# EAGLE board AnalogConversion_v3 (EAGLE 9.6.2)
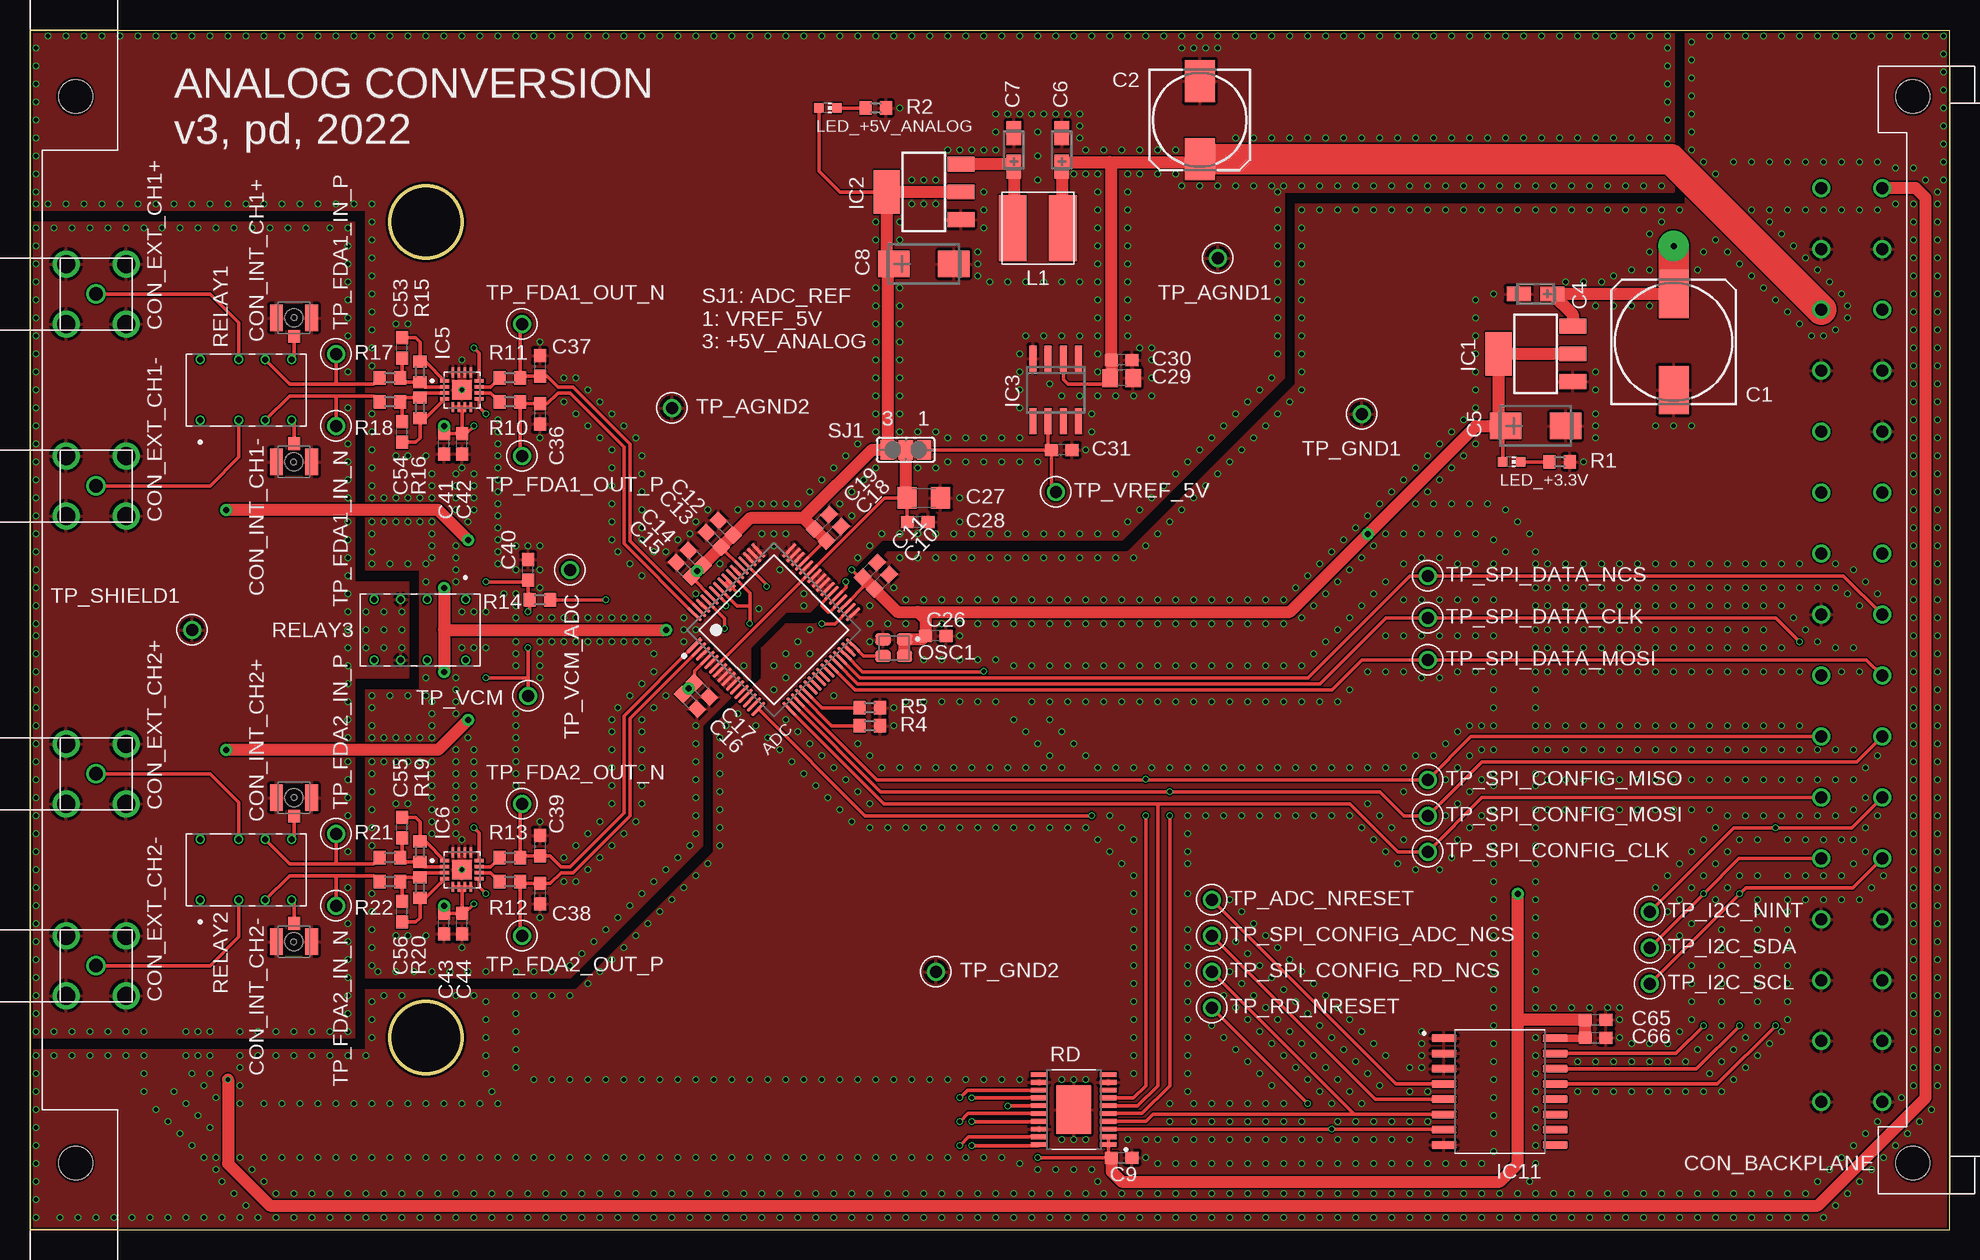
[diagram p6: board, top side]
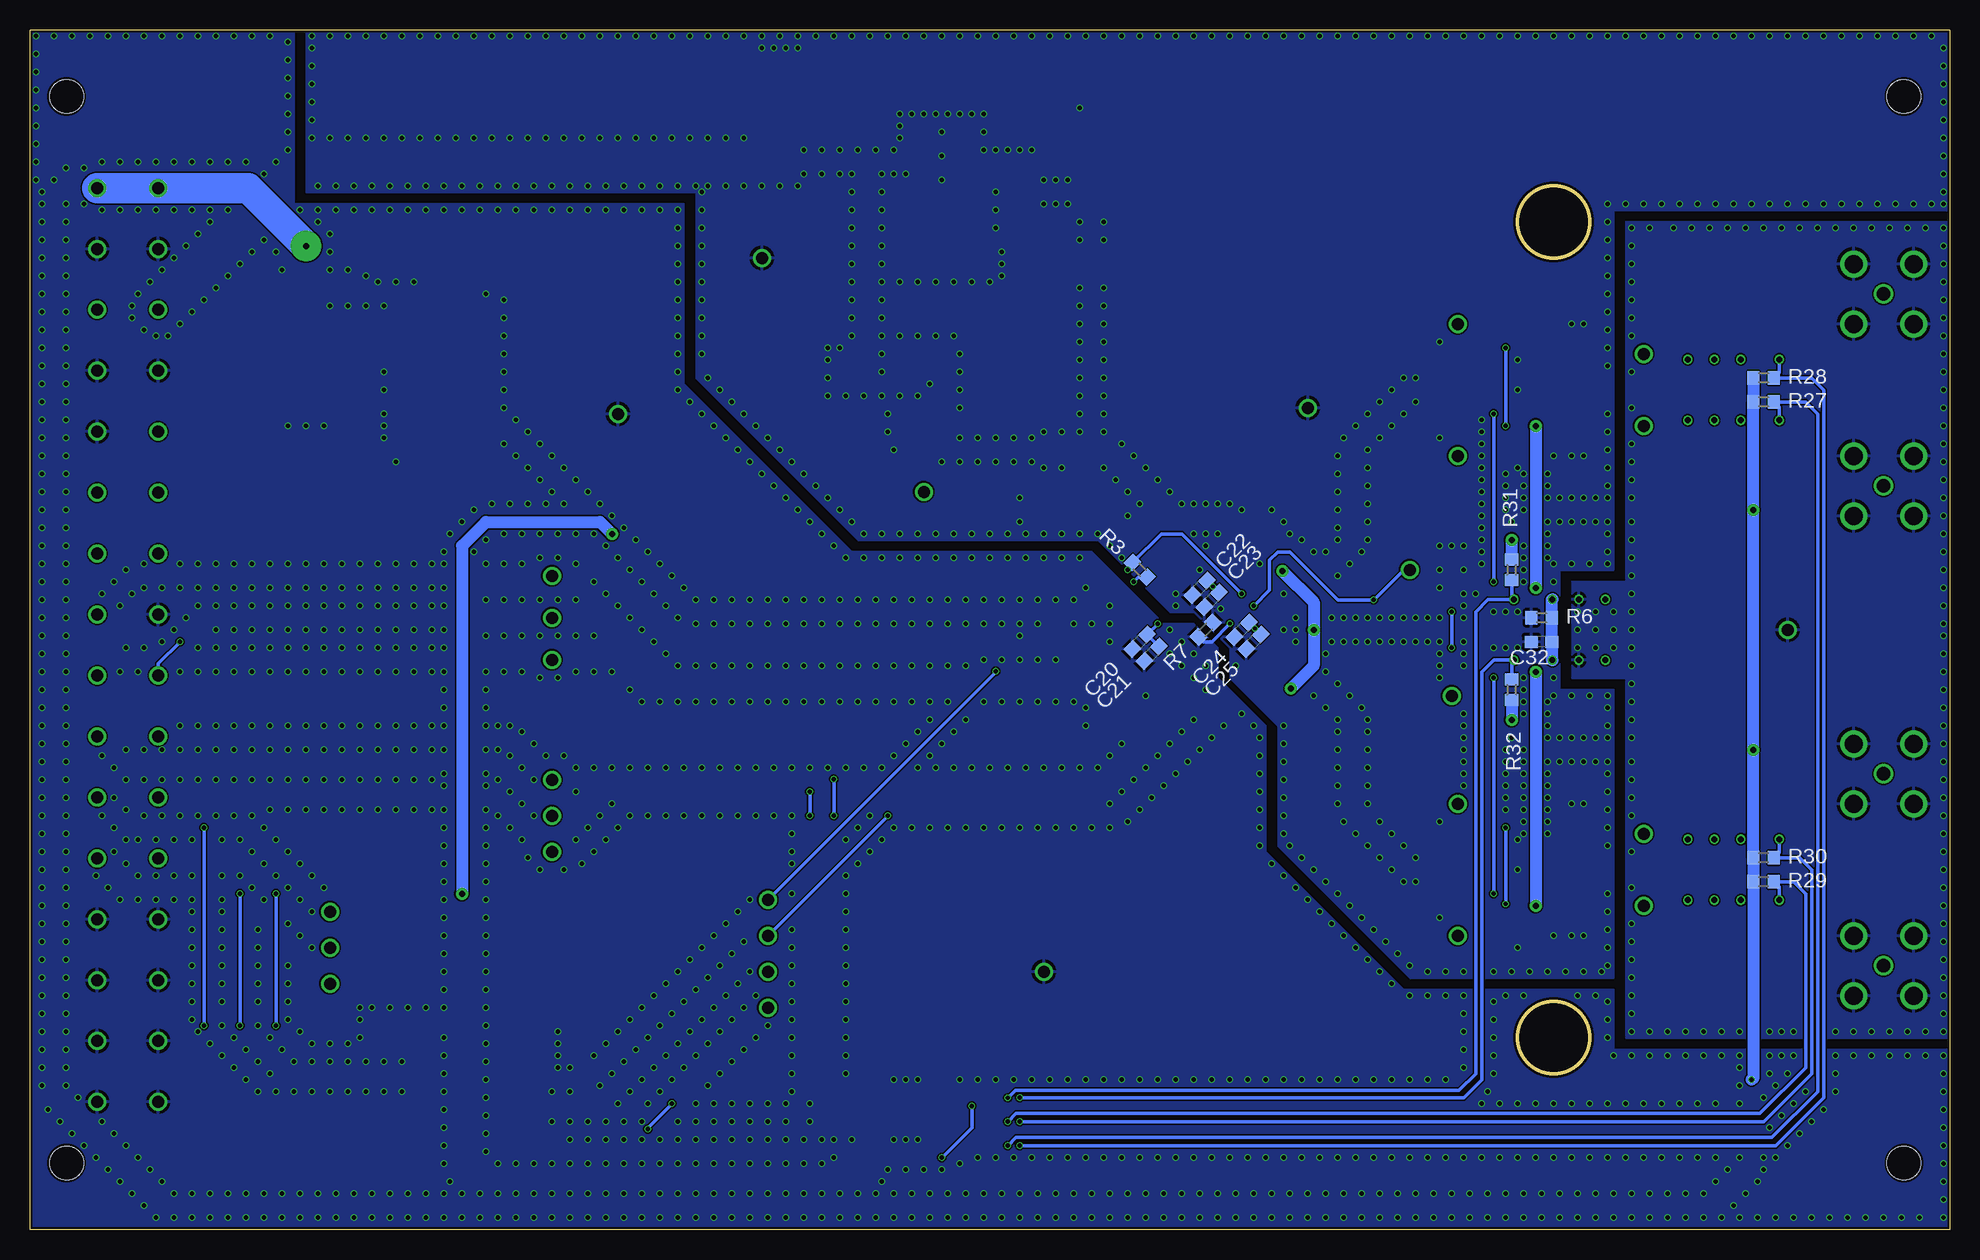
[diagram p7: board, bottom side, seen from below]

Size 160 x 100 mm. Coordinates in mm from the lower left corner, seen from the top.
Outline: 0,0 160,0 160,100 0,100 0,0
Outline: circle at 33,84 radius 3
Outline: circle at 33,16 radius 3
Copper layers (1*16): Top 0.035559375mm / dielectric 1.6mm / Bottom 0.035559375mm
Design rules "jlcpcb2layer": minimum track width 5mil, minimum drill 12mil, track to track 5mil, track to pad 5mil, pad to pad 5mil, via to via 5mil, smd to smd 5mil, copper to edge 8mil, drill to drill 6mil, minimum pad ring 5mil, minimum via ring 3mil, stop-mask expansion 2.5mil, vias tented up to drill 0mil, thermal gap 10mil

## Footprints (pad centres in the part's own frame; a part is rotated, then mirrored left to right if it is on the bottom)
AD7768-4BSTZ = smd 1.6 x 0.312: 1 -5.575,3.75; 2 -5.575,3.25; 3 -5.575,2.75; 4 -5.575,2.25; 5 -5.575,1.75; 6 -5.575,1.25; 7 -5.575,0.75; 8 -5.575,0.25; 9 -5.575,-0.25; 10 -5.575,-0.75; 11 -5.575,-1.25; 12 -5.575,-1.75; 13 -5.575,-2.25; 14 -5.575,-2.75; 15 -5.575,-3.25; 16 -5.575,-3.75; 33 5.575,-3.75; 34 5.575,-3.25; 35 5.575,-2.75; 36 5.575,-2.25; 37 5.575,-1.75; 38 5.575,-1.25; 39 5.575,-0.75; 40 5.575,-0.25; 41 5.575,0.25; 42 5.575,0.75; 43 5.575,1.25; 44 5.575,1.75; 45 5.575,2.25; 46 5.575,2.75; 47 5.575,3.25; 48 5.575,3.75 | smd 0.312 x 1.6: 17 -3.75,-5.575; 18 -3.25,-5.575; 19 -2.75,-5.575; 20 -2.25,-5.575; 21 -1.75,-5.575; 22 -1.25,-5.575; 23 -0.75,-5.575; 24 -0.25,-5.575; 25 0.25,-5.575; 26 0.75,-5.575; 27 1.25,-5.575; 28 1.75,-5.575; 29 2.25,-5.575; 30 2.75,-5.575; 31 3.25,-5.575; 32 3.75,-5.575; 49 3.75,5.575; 50 3.25,5.575; 51 2.75,5.575; 52 2.25,5.575; 53 1.75,5.575; 54 1.25,5.575; 55 0.75,5.575; 56 0.25,5.575; 57 -0.25,5.575; 58 -0.75,5.575; 59 -1.25,5.575; 60 -1.75,5.575; 61 -2.25,5.575; 62 -2.75,5.575; 63 -3.25,5.575; 64 -3.75,5.575
153CLV-1010 = smd 4 x 2.5: + 4,0; - -4,0
153CLV-0810 = smd 3.5 x 2.5: + 3.25,0; - -3.25,0
CT3216 = smd 2 x 1.2: + -1.4,0; - 1.4,0
CT6032 = smd 2.6 x 2.2: + -2.5,0; - 2.5,0
C0603 = smd 1.1 x 1: 1 -0.85,0; 2 0.85,0
C1206 = smd 1.6 x 1.8: 1 -1.4,0; 2 1.4,0
C0805 = smd 1.3 x 1.5: 1 -0.95,0; 2 0.95,0
09031326921 = drill 1: 1 36.83,10.7; 2 36.83,5.62; 3 31.75,10.7; 4 31.75,5.62; 5 26.67,10.7; 6 26.67,5.62; 7 21.59,10.7; 8 21.59,5.62; 9 16.51,10.7; 10 16.51,5.62; 11 11.43,10.7; 12 11.43,5.62; 13 6.35,10.7; 14 6.35,5.62; 15 1.27,10.7; 16 1.27,5.62; 17 -3.81,10.7; 18 -3.81,5.62; 19 -8.89,10.7; 20 -8.89,5.62; 21 -13.97,10.7; 22 -13.97,5.62; 23 -19.05,10.7; 24 -19.05,5.62; 25 -24.13,10.7; 26 -24.13,5.62; 27 -29.21,10.7; 28 -29.21,5.62; 29 -34.29,10.7; 30 -34.29,5.62; 31 -39.37,10.7; 32 -39.37,5.62 | hole 2.8: -44.45,3.05; 44.45,3.05
DELOCK_65848 = drill 1.5: G1 -2.5,2.5; G2 2.5,2.5; G3 -2.5,-2.5; G4 2.5,-2.5 | drill 1.1: S 0,0
2337019-1 = smd 1.05 x 2.2: G1 1.475,0; G2 -1.475,0 | smd 1 x 1.05: S 0,-1.525
SOT223 = smd 2.235 x 1.219: 1 -3.099,2.311; 2 -3.099,0; 3 -3.099,-2.311 | smd 2.2 x 3.6: TAB 3.099,0
ADR445ARZ = smd 0.6 x 2.2: 1 -1.905,-2.6; 2 -0.635,-2.6; 3 0.635,-2.6; 4 1.905,-2.6; 5 1.905,2.6; 6 0.635,2.6; 7 -0.635,2.6; 8 -1.905,2.6
ADA4945-1ACPZ-R7 = smd 0.84 x 0.26: 1 -1.435,0.75; 2 -1.435,0.25; 3 -1.435,-0.25; 4 -1.435,-0.75; 9 1.435,-0.75; 10 1.435,-0.25; 11 1.435,0.25; 12 1.435,0.75 | smd 0.26 x 0.84: 5 -0.75,-1.435; 6 -0.25,-1.435; 7 0.25,-1.435; 8 0.75,-1.435; 13 0.75,1.435; 14 0.25,1.435; 15 -0.25,1.435; 16 -0.75,1.435 | smd 1.6 x 1.6: 17 0,0
TCA9534ADWR = smd 2.06 x 0.6: 1 -4.64,4.445; 2 -4.64,3.175; 3 -4.64,1.905; 4 -4.64,0.635; 5 -4.64,-0.635; 6 -4.64,-1.905; 7 -4.64,-3.175; 8 -4.64,-4.445; 9 4.64,-4.445; 10 4.64,-3.175; 11 4.64,-1.905; 12 4.64,-0.635; 13 4.64,0.635; 14 4.64,1.905; 15 4.64,3.175; 16 4.64,4.445
VLS6045AF-101M = smd 2.3 x 5.5: 1 -2.1,0; 2 2.1,0
CHIP-LED0603 = smd 0.8 x 0.8: A 0,-0.75; C 0,0.75
SG-210STF-32.7680ML3 = smd 1.3 x 1: 1 -0.89,-0.69; 2 0.89,-0.69; 3 0.89,0.69; 4 -0.89,0.69
60807-011 = hole 2.8: 0,44.45; 0,-44.45
R0603 = smd 1 x 1.1: 1 -0.85,0; 2 0.85,0
MAX4820EUP+ = smd 1.48 x 0.41: 1 -2.875,2.925; 2 -2.875,2.275; 3 -2.875,1.625; 4 -2.875,0.975; 5 -2.875,0.325; 6 -2.875,-0.325; 7 -2.875,-0.975; 8 -2.875,-1.625; 9 -2.875,-2.275; 10 -2.875,-2.925; 11 2.875,-2.925; 12 2.875,-2.275; 13 2.875,-1.625; 14 2.875,-0.975; 15 2.875,-0.325; 16 2.875,0.325; 17 2.875,0.975; 18 2.875,1.625; 19 2.875,2.275; 20 2.875,2.925 | smd 2.84 x 4.04: 21 0,0
5-1462037-8 = drill 0.5: 1 -2.54,3.8; 2 -2.54,0.6; 3 -2.54,-1.6; 4 -2.54,-3.8; 5 2.54,-3.8; 6 2.54,-1.6; 7 2.54,0.6; 8 2.54,3.8
SJ_2 = smd 1.168 x 1.6: 1 -1.524,0; 2 0,0; 3 1.524,0
RSPRO-1MM-TERMINAL-POST-2622034 = drill 1: P$1 0,0

## Placement (x,y rotation side)
ADC  AD7768-4BSTZ  [AD7768-4BSTZ]  62,50 45 top
C1  1000u/16V  [153CLV-1010]  137,74 90 top
C2  100u/25V  [153CLV-0810]  97.5,92.5 270 top
C4  10u  [CT3216]  125.5,78 180 top
C5  22u  [CT6032]  125.5,67 0 top
C6  10u  [CT3216]  86,90 90 top
C7  10u  [CT3216]  82,90 90 top
C8  22u  [CT6032]  74.5,80.5 0 top
C9  100n  [C0603]  91,6 0 top
C10  100n  [C0603]  71,54 45 top
C11  1u  [C0603]  70,55 45 top
C12  100n  [C0603]  58,58.5 135 top
C13  1u  [C0603]  57,57.5 135 top
C14  100n  [C0603]  55.5,56 135 top
C15  1u  [C0603]  54.5,55 135 top
C16  100n  [C0603]  55,44 315 top
C17  1u  [C0603]  56,45 315 top
C18  100n  [C0603]  67,58 45 top
C19  1u  [C0603]  66,59 45 top
C20  100n  [C0603]  67.5,49 225 bottom
C21  10u  [C0603]  66.5,48 225 bottom
C22  100n  [C0603]  62.5,53.5 225 bottom
C23  1u  [C0603]  61.5,52.5 225 bottom
C24  100n  [C0603]  59,50 225 bottom
C25  1u  [C0603]  58,49 225 bottom
C26  100n  [C0603]  75.5,49.5 180 top
C27  22u  [C1206]  74.5,61 0 top
C28  100n  [C0603]  74,59 0 top
C29  10u/16V  [C0805]  91,71 180 top
C30  100n  [C0603]  91,72.5 180 top
C31  100n  [C0603]  86,65 180 top
C32  10n  [C0603]  34,49 180 bottom
C36  82p  [C0603]  42.5,68 270 top
C37  82p  [C0603]  42.5,72 270 top
C38  82p  [C0603]  42.5,28 270 top
C39  82p  [C0603]  42.5,32 270 top
C40  100n  [C0603]  41.5,55 90 top
C41  1u  [C0603]  34.5,65.5 90 top
C42  100n  [C0603]  36,65.5 90 top
C43  1u  [C0603]  34.5,25.5 90 top
C44  100n  [C0603]  36,25.5 90 top
C53  220p  [C0603]  31,73.5 90 top
C54  220p  [C0603]  31,66.5 90 top
C55  220p  [C0603]  31,33.5 90 top
C56  220p  [C0603]  31,26.5 90 top
C65  1u  [C0603]  130.5,17.5 0 top
C66  100n  [C0603]  130.5,16 0 top
CON_BACKPLANE  09031326921  [09031326921]  160,50 90 top
CON_EXT_CH1+  DELOCK_65848  [DELOCK_65848]  5.5,78 0 top
CON_EXT_CH1-  DELOCK_65848  [DELOCK_65848]  5.5,62 0 top
CON_EXT_CH2+  DELOCK_65848  [DELOCK_65848]  5.5,38 0 top
CON_EXT_CH2-  DELOCK_65848  [DELOCK_65848]  5.5,22 0 top
CON_INT_CH1+  2337019-1  [2337019-1]  22,76 0 top
CON_INT_CH1-  2337019-1  [2337019-1]  22,64 180 top
CON_INT_CH2+  2337019-1  [2337019-1]  22,36 0 top
CON_INT_CH2-  2337019-1  [2337019-1]  22,24 180 top
IC1  LM1117IMP-3.3  [SOT223]  125.5,73 180 top
IC2  LM1117MP-5.0  [SOT223]  74.5,86.5 180 top
IC3  ADR445ARZ  [ADR445ARZ]  85.5,70 180 top
IC5  ADA4945-1ACPZ-R7  [ADA4945-1ACPZ-R7]  36,70 0 top
IC6  ADA4945-1ACPZ-R7  [ADA4945-1ACPZ-R7]  36,30 0 top
IC11  TCA9534ADWR  [TCA9534ADWR]  122.5,11.5 0 top
L1  100u  [VLS6045AF-101M]  84,83.5 180 top
LED_+3.3V  [CHIP-LED0603]  123.5,64 270 top
LED_+5V_ANALOG  [CHIP-LED0603]  66.5,93.5 270 top
OSC1  SG-210STF 32.7680ML3  [SG-210STF-32.7680ML3]  72,48.5 180 top
PCB_BRACKET  60807-011  [60807-011]  3.8,50 0 top
R1  750  [R0603]  127.5,64 0 top
R2  1.8k  [R0603]  70.5,93.5 0 top
R3  10k  [R0603]  67.5,55 315 bottom
R4  1k  [R0603]  70,42 180 top
R5  1k  [R0603]  70,43.5 180 top
R6  1M  [R0603]  34,51 180 bottom
R7  0  [R0603]  62,50 225 bottom
R10  82  [R0603]  40,69 180 top
R11  82  [R0603]  40,71 180 top
R12  82  [R0603]  40,29 180 top
R13  82  [R0603]  40,31 180 top
R14  47  [R0603]  42.5,52.5 180 top
R15  470  [R0603]  32.5,71.5 270 top
R16  470  [R0603]  32.5,68.5 90 top
R17  470  [R0603]  30,71 180 top
R18  470  [R0603]  30,69 180 top
R19  470  [R0603]  32.5,31.5 270 top
R20  470  [R0603]  32.5,28.5 90 top
R21  470  [R0603]  30,31 180 top
R22  470  [R0603]  30,29 180 top
R27  100  [R0603]  15.5,69 180 bottom
R28  100  [R0603]  15.5,71 180 bottom
R29  100  [R0603]  15.5,29 180 bottom
R30  100  [R0603]  15.5,31 180 bottom
R31  100  [R0603]  36.5,55 90 bottom
R32  100  [R0603]  36.5,45 270 bottom
RD  MAX4820EUP+  [MAX4820EUP+]  87,10 180 top
RELAY1  5-1462037-8  [5-1462037-8]  18,70 90 top
RELAY2  5-1462037-8  [5-1462037-8]  18,30 90 top
RELAY3  5-1462037-8  [5-1462037-8]  32.5,50 270 top
SJ1  [SJ_2]  73,65 180 top
TP_ADC_NRESET  [RSPRO-1MM-TERMINAL-POST-2622034]  98.5,27.5 0 top
TP_AGND1  [RSPRO-1MM-TERMINAL-POST-2622034]  99,81 180 top
TP_AGND2  [RSPRO-1MM-TERMINAL-POST-2622034]  53.5,68.5 180 top
TP_FDA1_IN_N  [RSPRO-1MM-TERMINAL-POST-2622034]  25.5,67 0 top
TP_FDA1_IN_P  [RSPRO-1MM-TERMINAL-POST-2622034]  25.5,73 0 top
TP_FDA1_OUT_N  [RSPRO-1MM-TERMINAL-POST-2622034]  41,75.5 0 top
TP_FDA1_OUT_P  [RSPRO-1MM-TERMINAL-POST-2622034]  41,64.5 0 top
TP_FDA2_IN_N  [RSPRO-1MM-TERMINAL-POST-2622034]  25.5,27 0 top
TP_FDA2_IN_P  [RSPRO-1MM-TERMINAL-POST-2622034]  25.5,33 0 top
TP_FDA2_OUT_N  [RSPRO-1MM-TERMINAL-POST-2622034]  41,35.5 0 top
TP_FDA2_OUT_P  [RSPRO-1MM-TERMINAL-POST-2622034]  41,24.5 0 top
TP_GND1  [RSPRO-1MM-TERMINAL-POST-2622034]  111,68 0 top
TP_GND2  [RSPRO-1MM-TERMINAL-POST-2622034]  75.5,21.5 180 top
TP_I2C_NINT  [RSPRO-1MM-TERMINAL-POST-2622034]  135,26.5 0 top
TP_I2C_SCL  [RSPRO-1MM-TERMINAL-POST-2622034]  135,20.5 0 top
TP_I2C_SDA  [RSPRO-1MM-TERMINAL-POST-2622034]  135,23.5 0 top
TP_RD_NRESET  [RSPRO-1MM-TERMINAL-POST-2622034]  98.5,18.5 0 top
TP_SHIELD1  [RSPRO-1MM-TERMINAL-POST-2622034]  13.5,50 0 top
TP_SPI_CONFIG_ADC_NCS  [RSPRO-1MM-TERMINAL-POST-2622034]  98.5,24.5 0 top
TP_SPI_CONFIG_CLK  [RSPRO-1MM-TERMINAL-POST-2622034]  116.5,31.5 0 top
TP_SPI_CONFIG_MISO  [RSPRO-1MM-TERMINAL-POST-2622034]  116.5,37.5 0 top
TP_SPI_CONFIG_MOSI  [RSPRO-1MM-TERMINAL-POST-2622034]  116.5,34.5 0 top
TP_SPI_CONFIG_RD_NCS  [RSPRO-1MM-TERMINAL-POST-2622034]  98.5,21.5 0 top
TP_SPI_DATA_CLK  [RSPRO-1MM-TERMINAL-POST-2622034]  116.5,51 0 top
TP_SPI_DATA_MOSI  [RSPRO-1MM-TERMINAL-POST-2622034]  116.5,47.5 0 top
TP_SPI_DATA_NCS  [RSPRO-1MM-TERMINAL-POST-2622034]  116.5,54.5 0 top
TP_VCM  [RSPRO-1MM-TERMINAL-POST-2622034]  41.5,44.5 0 top
TP_VCM_ADC  [RSPRO-1MM-TERMINAL-POST-2622034]  45,55 0 top
TP_VREF_5V  [RSPRO-1MM-TERMINAL-POST-2622034]  85.5,61.5 180 top

## Tracks (layer width: path | path; a pad name or v marks a point on that pad's centre or on a via)
+3V3  (via drill 0.35, 0.5 pad 1)
  Top 0.305: RD.15 81.53,10.32 v81.5,10.3 | v84,6 90,6 | 90,6 C9.1 | RD.2 RD.1 89.88,6.12 90,6 | ADC.35 69.79,53.9 69.9,53.9 | ADC.57 58.06,53.94 | 58.06,53.94 ADC.56 | 58.06,53.94 v59,53 | v59,53 | v68.5,55 69.1,54.4 C11.1 | LED_+3.3V.A 122.75,66.75 C5.+
  Top 0.61: IC11.16 129.59,15.95 C66.1
  Top 1.016: C9.1 90.15,4.85 91,4 122.5,4 124,5.5 124,17.5 | C66.1 C65.1 124,17.5 | C11.1 69.9,53.9 C10.1 72.3,51.5 74,51.5 | OSC1.4 OSC1.1 74.34,49.19 C26.2 74.65,50.85 74,51.5 | 124,17.5 v124,28 | 74,51.5 105,51.5 v111.5,58 120.5,67 122.5,67 | 122.5,67 C5.+ | IC1.2 IC1.TAB 122.4,67.1 122.5,67
  Bottom 0.305: v81.5,10.3 81.5,8.5 v84,6 | v59,53 64,58 65.7,58 R3.1 68.5,55.2 v68.5,55
  Bottom 1.016: v111.5,58 112.5,59 122,59 124,57 v124,28
+5V  (via drill 0.35, 0.5 pad 1, 0.5 pad 2.54)
  Top 1.016: IC1.3 128.6,76.3 C4.+ C1.+ | v36.5,57.5 34,60 v16.35,60 | v36.5,42.5 34,40 v16.35,40 | v16.5,12.5 16.5,5.5 20,2 149,2 158,11 158,86 157.17,86.83 CON_BACKPLANE.2
  Top 2.54: v137,82 C1.+
  Bottom 1.016: R28.2 R27.2 v16.35,60 v16.35,40 R30.2 R29.2 16.35,12.65 v16.5,12.5 | R31.2 v36.5,57.5 | R32.2 v36.5,42.5
  Bottom 2.54: CON_BACKPLANE.2 CON_BACKPLANE.1 141.83,86.83 v137,82
+5V_ANALOG  (via drill 0.35, 0.5 pad 1)
  Top 0.305: ADC.4 55.4,46.58 C17.1 | IC5.5 IC5.6 36,68.56 | 36,68.56 IC5.7 IC5.8 | IC5.12 37.44,73.06 v37,73.5 | IC6.5 IC6.6 | IC6.6 IC6.7 IC6.8 | IC6.12 37.44,33.06 v37,33.5 | C43.2 C44.2 | v37,27.15 36.2,26.35 C44.2 | IC6.6 36,28.32 C44.2 | C42.2 36.35,66.35 v37,67 | 36,68.56 C42.2 | ADC.60 55.13,54.4 C15.1 | ADC.53 57.6,56.87 C13.1 | ADC.45 66.22,57.4 C18.1 | LED_+5V_ANALOG.A 65.75,88.25 67.5,86.5 IC2.TAB | C42.2 C41.2
  Top 1.016: C15.1 v55.6,54.9 C14.1 C13.1 C12.1 60,59.3 64.5,59.3 | C18.1 C19.1 64.5,59.3 | C16.1 v54.9,45.1 C17.1 | C43.2 v34.5,27 | 34.5,50 v34.5,46.5 | 34.5,50 v53,50 | 64.5,59.3 70.2,65 SJ1.3 71.48,79.98 C8.+ 71.4,81.1 IC2.TAB IC2.2 | v34.5,53.5 34.5,50 | C41.2 v34.5,67
  Bottom 0.305: v37,73.5 v37,67 | v37,33.5 v37,27.15
  Bottom 1.016: v54.9,45.1 53,47 v53,50 53,52.3 v55.6,54.9 | v34.5,46.5 v34.5,27 | v34.5,67 v34.5,53.5
+12V
  Top 0.305: L1.1 86.05,83.55 | IC3.2 86.14,70.86 86.5,70.5 89.55,70.5 C29.2
  Top 1.016: 86.05,83.55 86,83.6 C6.+ 86.4,89 90,89 | CON_BACKPLANE.5 149.3,76.7 | C2.+ 97.25,89 90,89 | 90,89 90.15,88.85 C30.2 90.15,71.1 C29.2
  Top 2.54: C2.+ 136.75,89.25 149.3,76.7
ADC_AIN0_N
  Top 0.305: ADC.63 50,57.4 50,65.5 45.25,70.25 44,70.25 43.1,71.15 C37.2 41,71.15 R11.1 40.85,75.35 TP_FDA1_OUT_N.P$1
ADC_AIN0_P
  Top 0.305: ADC.64 49.5,57.2 49.5,65.25 45,69.75 44,69.75 43.1,68.85 C36.1 41,68.85 R10.1 40.85,64.65 TP_FDA1_OUT_P.P$1
ADC_AIN1_N
  Top 0.305: ADC.1 49.5,42.8 49.5,34.75 45,30.25 44.25,30.25 43.35,31.15 C39.2 41,31.15 R13.1 40.85,35.35 TP_FDA2_OUT_N.P$1
ADC_AIN1_P
  Top 0.305: ADC.2 50,42.6 50,34.5 45.25,29.75 44.25,29.75 43.35,28.85 C38.1 41,28.85 R12.1 40.85,24.65 TP_FDA2_OUT_P.P$1
ADC_MCLK
  Top 0.305: ADC.32 69.49,47.81 OSC1.3
ADC_NRESET  (via drill 0.35)
  Top 0.305: ADC.30 69.39,46.5 79.46,46.5 v79.5,46.54 | IC11.4 113.86,12.13 TP_ADC_NRESET.P$1
  Bottom 0.305: TP_ADC_NRESET.P$1 79.5,46.5 v79.5,46.54
ADC_REF
  Top 0.305: ADC.6 ADC.43 71.23,61 C27.1 73.1,59.05 C28.1
  Top 1.016: C27.1 73,61.1 SJ1.2
AGND  (via drill 0.35)
  other vias: 53,56.5 54,57.5 55.5,59 56.5,60 55.5,53 61,58 62,58 63,58 64.5,53 62.5,55 67.5,60.5 68.5,59.5 77.5,59 77.5,61 88,65 93.5,71 93.5,72.5 82.5,73 79,81.5 79,80.5 79,79.5 79.5,83.5 79.5,85 81.5,93 82.5,93 85.5,93 86.5,93 72.5,93.5 96,98.5 97,98.5 98,98.5 99,98.5 42.5,66 42.5,74 33,64.5 36,63.5 36,70 42.5,26 42.5,34 36,23.5 33,24.5 36,30 41.5,57 36,51.5 36,48.5 37,48.5 37,51.5 33,54 33,46 36,72.5 36,32.5 38,51.5 38,48.5 40.5,51 40.5,49 42.5,51 42.5,49 43.5,49 43.5,51 44.5,51 44.5,49 45.5,49 45.5,51 46.5,51 46.5,49 47.5,49 47.5,51 48.5,51 48.5,49 49.5,49 49.5,51 50.5,51 51.5,51 51.5,49 50.5,49 54.5,51 54.5,50 54.5,49 64.5,52 59.5,47 55.5,50 62,57 77,58 75.5,58 74,58 72.5,58 71,58 70,57 69,56 78.5,58 80,58 81.5,58 83,58 84.5,58 86,58 87.5,58 89,58 90.5,58 91.5,59 92.5,60 93.5,61 94.5,62 95.5,63 96.5,64 97.5,65 98.5,66 99.5,67 100.5,68 101.5,69 102.5,70 103.5,71 104,73 104,74.5 104,76 104,77.5 104,79 104,80.5 104,82 104,83.5 104,85 104,86.5 104.5,87 106,87 107.5,87 109,87 110.5,87 112,87 113.5,87 115,87 116.5,87 118,87 119.5,87 121,87 122.5,87 124,87 125.5,87 127,87 128.5,87 130,87 131.5,87 133,87 134.5,87 136,87 136.5,91 136.5,92.5 136.5,94 136.5,95.5 136.5,97 136.5,98.5 136.5,99.5 135,99.5 133.5,99.5 132,99.5 130.5,99.5 135,91 133.5,91 132,91 130.5,91 129,91 127.5,91 126,91 124.5,91 123,91 121.5,91 120,91 118.5,91 117,91 115.5,91 114,91 112.5,91 111,91 109.5,91 108,91 106.5,91 105,91 103.5,91 102,91 100.5,91 95.5,90 94,90 92.5,90 91,90 89.5,90 88,90 87.5,93 87.5,92 87.5,91 84.5,93 83.5,93 103.5,87 102,87 100.5,87 99,87 97.5,87 96,87 94,88 92.5,88 91.5,88 95.5,88 91.5,86.5 89,88 88,88 87,88 89,86.5 89,85 89,83.5 91.5,85 91.5,83.5 91.5,82 89,82 89,80.5 89,79 91.5,80.5 91.5,79 91.5,77.5 91.5,76 91.5,74.5 89,77.5 89,76 89,74.5 89,73 89,71.5 89,69.5 90.5,69.5 92,69.5 93.5,69.5 93.5,73.5 92.5,73.5 87.5,79 86,79 84.5,79 83,79 81.5,79 80,79 79.5,86.5 80.5,93 80.5,91.5 80.5,90 79.5,90 78.5,90 77.5,90 76.5,90 75.5,87.5 73.5,87.5 73.5,85.5 75.5,85.5 74.5,87.5 74.5,85.5 72.5,84 72.5,82.5 70.5,84 70.5,82.5 70.5,78.5 72.5,78.5 72.5,77 70.5,77 70.5,75.5 72.5,75.5 70.5,74 70.5,72.5 70.5,71 70.5,69.5 70.5,68 72.5,68 72.5,69.5 72.5,71 72.5,72.5 72.5,74 70.5,66.5 72.5,66.5 74,66.5 75.5,66.5 76.5,66 76.5,64 78,64 79.5,64 81,64 82.5,64 84,64 82.5,66 81,66 79.5,66 78,66 75.5,63.5 74,63.5 70.5,63.5 69.5,62.5 68.5,61.5 69,65.5 68,64.5 67,63.5 66,62.5 65,61.5 64,60.5 63,60.5 62,60.5 61,60.5 60,60.5 59,60 55,58 57.5,55.5 60.75,51.75 87.5,69.5 86,69.5 85,70.5 86,74.5 87.5,74.5 84.5,74.5 83,74.5 82.5,71.5 82.5,70 82.5,68.5 88.5,66.5 88.5,68 84,87.5 84,89.5 84,91.5 30,99.5 28.5,99.5 27,99.5 25.5,99.5 24,99.5 22.5,99.5 21,99.5 19.5,99.5 18,99.5 16.5,99.5 15,99.5 13.5,99.5 12,99.5 10.5,99.5 9,99.5 7.5,99.5 6,99.5 4.5,99.5 3,99.5 1.5,99.5 63,99.5 61.5,99.5 60,99.5 58.5,99.5 57,99.5 55.5,99.5 54,99.5 52.5,99.5 51,99.5 49.5,99.5 48,99.5 46.5,99.5 45,99.5 43.5,99.5 42,99.5 40.5,99.5 39,99.5 37.5,99.5 36,99.5 34.5,99.5 33,99.5 31.5,99.5 96,99.5 94.5,99.5 93,99.5 91.5,99.5 90,99.5 88.5,99.5 87,99.5 85.5,99.5 84,99.5 82.5,99.5 81,99.5 79.5,99.5 78,99.5 76.5,99.5 75,99.5 73.5,99.5 72,99.5 70.5,99.5 69,99.5 67.5,99.5 66,99.5 64.5,99.5 129,99.5 127.5,99.5 126,99.5 124.5,99.5 123,99.5 121.5,99.5 120,99.5 118.5,99.5 117,99.5 115.5,99.5 114,99.5 112.5,99.5 111,99.5 109.5,99.5 108,99.5 106.5,99.5 105,99.5 103.5,99.5 102,99.5 100.5,99.5 99,99.5 97.5,99.5 0.5,98.5 0.5,97 0.5,95.5 0.5,94 0.5,92.5 0.5,91 0.5,89.5 0.5,88 0.5,86.5 0.5,85.5 1.5,85.5 3,85.5 4.5,85.5 6,85.5 7.5,85.5 9,85.5 10.5,85.5 12,85.5 13.5,85.5 15,85.5 16.5,85.5 18,85.5 19.5,85.5 21,85.5 22.5,85.5 24,85.5 25.5,85.5 27,85.5 28.5,85.5 28.5,84 28.5,82.5 28.5,81 28.5,79.5 28.5,78 28.5,76.5 28.5,75 28.5,73.5 28.5,72 28.5,68 28.5,66.5 28.5,65 28.5,63.5 28.5,62 28.5,61 28.5,59 28.5,58 28.5,56.5 28.5,55.5 30,55.5 31.5,55.5 33,55.5 33,44.5 31.5,44.5 30,44.5 28.5,44.5 28.5,43.5 28.5,42 28.5,41 28.5,39 28.5,38 28.5,36.5 28.5,35 28.5,33.5 28.5,32 28.5,28 28.5,26.5 28.5,25 28.5,23.5 28.5,22 29,21.5 30.5,21.5 32,21.5 33.5,21.5 35,21.5 36.5,21.5 38,21.5 40.5,21.5 42,21.5 43.5,21.5 45,22 46,23 47,24 48,25 49,26 50,27 51,28 52,29 53,30 54,31 55,32 55.5,33 55.5,34.5 55.5,36 55.5,37.5 55.5,39 55.5,40.5 55.5,42 29.5,59 30.5,59 31.5,59 32.5,59 33.5,59 33.5,61 32.5,61 31.5,61 30.5,61 29.5,61 29.5,39 30.5,39 31.5,39 32.5,39 33.5,39 33.5,41 32.5,41 31.5,41 30.5,41 29.5,41 33.5,42 33.5,43 33.5,44 33.5,58 33.5,57 33.5,56 35.5,57 35.5,56 35.5,55 35.5,54 35.5,43 35.5,44 35.5,45 35.5,46 36.5,41 35.5,40 36.5,59 35.5,60 33.5,62 33.5,63 35.5,61 35.5,62 35.5,63 33.5,38 33.5,37 33.5,36 33.5,35 33.5,34 33.5,33 35.5,39 35.5,38 35.5,37 35.5,36 35.5,35 35.5,34 35.5,33 31.5,35.5 30.5,35.5 30.5,24.5 31.5,24.5 30.5,75.5 31.5,75.5 30.5,64.5 31.5,64.5 37,35 37,36 37,37 37,38 37,39 37,40 37,60 37,61 37,62 37,63 39,67.5 39,66.5 39,65.5 39,64.5 39,63.5 39,62.5 39,61.5 39,60.5 39,59.5 39,58.5 39,57.5 39,56.5 39,55.5 40.5,55 42.5,55 40.5,52 40.5,53 39.5,53 42.5,53.5 42.5,57 40.5,57 42.5,48 42.5,47 42.5,46 40.5,48 40.5,47 40.5,43 40.5,42 40.5,41 40.5,40 40.5,39 40.5,38 40.5,37 44.5,29 44.5,31 45.5,32 46.5,33 47.5,34 48.5,35.5 45.5,29 46.5,30 47.5,31 48.5,32 49.5,33 50.5,34 51,35.5 51,37 51,38.5 48.5,37 48.5,38.5 51,40 51,41.5 51,42.5 52,43.5 53,44.5 48.5,40 48.5,41.5 48.5,42.5 49,43.5 50,44.5 51,45.5 52,46.5 52,48 44.5,69 44.5,71 45.5,71 46.5,70 47.5,69 48.5,68 49.5,67 50.5,66 51,64.5 51,63 51,61.5 51,60 51,58.5 51,57.5 52,56.5 45.5,68 46.5,67 47.5,66 48.5,65 48.5,63.5 48.5,62 48.5,60.5 48.5,59 48.5,57.5 49,56.5 50,55.5 51,54.5
  pour Top: 28,55 28,85 0,85 0,100 137,100 137,86.5 104.5,86.5 104.5,71 91,57.5 71,57.5 65,51.5 63,51.5 60,48.5 60,46 56,42 56,32 45,21 28,21 28,45 32.5,45 32.5,55
  pour Bottom: 28,55 28,85 0,85 0,100 137,100 137,86.5 104.5,86.5 104.5,71 91,57.5 71,57.5 65,51.5 63,51.5 60,48.5 60,46 56,42 56,32 45,21 28,21 28,45 32.5,45 32.5,55
CON_EXT_CH1+
  Top 0.305: CON_EXT_CH1+.S 15,78 17.4,75.6 RELAY1.7
CON_EXT_CH1-
  Top 0.305: CON_EXT_CH1-.S 15,62 17.4,64.4 RELAY1.2
CON_EXT_CH2+
  Top 0.305: CON_EXT_CH2+.S 15,38 17.4,35.6 RELAY2.7
CON_EXT_CH2-
  Top 0.305: CON_EXT_CH2-.S 15,22 17.4,24.4 RELAY2.2
CON_INT_CH1+
  Top 0.305: RELAY1.5 22,72.74 CON_INT_CH1+.S
CON_INT_CH1-
  Top 0.305: RELAY1.4 22,67.26 CON_INT_CH1-.S
CON_INT_CH2+
  Top 0.305: RELAY2.5 22,32.74 CON_INT_CH2+.S
CON_INT_CH2-
  Top 0.305: RELAY2.4 22,27.26 CON_INT_CH2-.S
DIN
  Top 0.305: R5.2 66.03,43.5 ADC.21
DNC/DGND
  Top 0.305: R4.2 66.82,42 ADC.20
DREGCAP  (via drill 0.35)
  Top 0.305: ADC.34 67.1,50.5 v66,50.5
  Bottom 0.305: v66,50.5 C20.1 C21.1
FDA1_IN_N
  Top 0.305: 25.5,69.5 21.64,69.5 RELAY1.3 | TP_FDA1_IN_N.P$1 25.5,69.5 | R18.2 28.65,69.5 25.5,69.5
FDA1_IN_P
  Top 0.305: 25.5,70.5 21.64,70.5 RELAY1.6 | TP_FDA1_IN_P.P$1 25.5,70.5 | R17.2 28.65,70.5 25.5,70.5
FDA2_IN_N
  Top 0.305: 25.5,29.5 21.64,29.5 RELAY2.3 | TP_FDA2_IN_N.P$1 25.5,29.5 | R22.2 28.65,29.5 25.5,29.5
FDA2_IN_P
  Top 0.305: 25.5,30.5 21.64,30.5 RELAY2.6 | TP_FDA2_IN_P.P$1 25.5,30.5 | R21.2 28.65,30.5 25.5,30.5
GND  (via drill 0.35)
  Top 0.305: ADC.55 60,53.06 60,52 | 60,52 58.94,52 ADC.58 | 60,52 60,50.53 v59.98,50.52
  Bottom 0.305: v59.98,50.52 61.5,49 62.2,49 R7.2
  other vias: 129.5,64 122,78 93,6 132.5,16 132.5,17.5 87,7.5 87,12.5 72,43.5 72,42 130.5,71.5 130.5,70 130.5,68 130.5,66 130.5,67 137,67 135.5,67 138.5,67 64,49 63,42.5 64,41.5 65,40.5 66,39.5 67,38.5 68,37.5 69,36.5 70,35.5 69,40.5 70,39.5 71,38.5 72.5,38.5 74,38.5 75.5,38.5 61.5,41 62.5,40 63.5,39 64.5,38 65.5,37 66.5,36 67.5,35 68.5,34 70,33.5 71.5,33.5 73,33.5 74.5,33.5 76,33.5 77.5,33.5 79,33.5 80.5,33.5 82,33.5 83.5,33.5 85,33.5 86.5,33.5 88,33.5 77,38.5 78.5,38.5 80,38.5 81.5,38.5 83,38.5 84.5,38.5 86,38.5 89,38.5 90.5,38.5 92,38.5 93.5,38.5 95,38.5 96.5,38.5 90,34.5 91,33.5 92,32.5 89,32.5 90,31.5 91,30.5 92,29.5 96.5,34.5 96.5,33 96.5,31.5 96.5,28 92,28 92,26.5 92,25 92,23.5 92,22 92,20.5 92,19 92,17.5 92,16 92,14.5 92,13 96.5,25 96.5,23.5 96.5,22 96.5,20.5 96.5,19 96.5,17.5 96.5,16 96.5,14.5 96.5,13 96.5,11.5 95,10.5 98,38.5 99.5,38.5 101,38.5 102.5,38.5 104,38.5 105.5,38.5 107,38.5 108.5,38.5 110,38.5 111.5,38.5 113,38.5 114.5,38.5 98,34.5 99.5,34.5 101,34.5 102.5,34.5 104,34.5 105.5,34.5 107,34.5 108.5,34.5 110,34.5 111,33.5 112,32.5 113,31.5 114,30.5 111.5,35.5 112.5,34.5 113.5,33.5 114.5,32.5 114.5,36.5 67,44.5 74.5,47.5 76,47.5 77.5,47.5 79,47.5 80.5,47.5 82,47 73,50.5 71.5,50.5 70,50.5 77.5,49.5 83.5,47 85,47 86.5,47 88,47 74.5,44 73,44 76,44 77.5,44 79,44 80.5,44 83.5,44 85,44 86.5,44 88,44 85,39.5 84,40.5 83,41.5 82,42.5 85,42.5 86,41.5 87,40.5 88,39.5 89.5,44 91,44 92.5,44 94,44 95.5,44 97,44 97,47 95.5,47 94,47 92.5,47 91,47 89.5,47 98.5,47 100,47 101.5,47 103,47 104.5,47 106,47 98.5,44 100,44 101.5,44 103,44 104.5,44 106,44 107.5,44 109,44 110,45 111.5,46.5 113,46.5 114.5,46.5 107,48 108,49 109,50 110,51 111,52 112,53 113,54 114.5,55.5 113,49.5 114.5,49.5 116,49.5 117.5,49.5 114.5,52.5 116,52.5 117.5,52.5 116,46 117.5,46 119,52.5 120.5,52.5 122,52.5 122,49.5 120.5,49.5 119,49.5 119,46.5 120.5,46.5 122,46.5 116,56 117.5,56 119,55.5 120.5,55.5 122,55.5 72,53.5 73,52.5 74.5,52.5 76,52.5 77.5,52.5 79,52.5 80.5,52.5 82,52.5 83.5,52.5 85,52.5 79,50.5 80.5,50.5 77.5,50.5 76,50.5 70,49 82,50.5 83.5,50.5 85,50.5 70,52 86.5,52.5 88,52.5 89.5,52.5 91,52.5 92.5,52.5 94,52.5 86.5,50.5 88,50.5 89.5,50.5 91,50.5 92.5,50.5 94,50.5 95.5,50.5 97,50.5 98.5,50.5 100,50.5 101.5,50.5 103,50.5 104.5,50.5 95.5,52.5 97,52.5 98.5,52.5 100,52.5 101.5,52.5 103,52.5 104.5,52.5 105.5,53.5 106.5,54.5 107.5,55.5 106,51 107,52 108,53 109,54 110,55 111,56 112,57 113,58 108.5,56.5 109.5,57.5 110.5,58.5 111.5,59.5 112.5,60.5 113.5,61.5 114.5,62.5 115.5,63.5 116.5,64.5 117.5,65.5 118.5,66.5 119.5,67.5 120.5,68.5 120.5,70 120.5,71.5 120.5,73 120.5,74.5 120.5,76 120.5,77.5 115.5,60.5 116.5,61.5 117.5,62.5 118.5,63.5 119.5,64.5 120.5,65.5 114.5,58 116,58 117.5,58 119,58 120.5,58 122,57.5 123,56.5 117,60.5 118.5,60.5 120,60.5 121.5,60.5 123,60 124,59 125,58 125.5,56.5 125.5,55.5 125.5,53.5 125.5,52 125.5,50 125.5,48.5 125.5,46.5 125.5,45 125.5,43.5 125.5,42 122,45 122,43.5 122,42 122,40 125.5,40 125.5,38 125.5,37 122,38 122,37 122,35 125.5,35 125.5,33.5 125.5,32 125.5,30.5 125.5,29 125.5,27.5 125.5,26 125.5,24.5 125.5,23 125.5,21.5 125.5,20 125.5,18.5 127,18.5 128.5,18.5 130,18.5 131.5,18.5 132.5,18.5 122,33.5 122,32 122,30.5 122,29 122,27.5 122,26 122,24.5 122,23 122,21.5 122,20 122,18.5 122,17 122,15.5 122,14 122,12.5 122,11 122,9.5 122,8 122,6.5 121,5.5 119.5,5.5 118,5.5 116.5,5.5 115,5.5 113.5,5.5 112,5.5 110.5,5.5 109,5.5 107.5,5.5 106,5.5 106,3 107.5,3 109,3 110.5,3 112,3 113.5,3 115,3 116.5,3 118,3 119.5,3 121,3 122.5,3 124,3 104.5,3 103,3 101.5,3 100,3 98.5,3 97,3 95.5,3 94,3 92.5,3 91,3 89.5,3 88,3 86.5,3 85,3 83.5,3 82,3 89,4 88.5,5 87,5 85.5,5 84,5 82.5,5.5 81,6 79.5,6 78,6 76.5,6 75,6 73.5,6 106,1 107.5,1 109,1 110.5,1 112,1 113.5,1 115,1 116.5,1 118,1 119.5,1 121,1 122.5,1 124,1 104.5,1 103,1 101.5,1 100,1 98.5,1 97,1 95.5,1 94,1 92.5,1 91,1 89.5,1 104.5,5.5 103,5.5 101.5,5.5 100,5.5 98.5,5.5 97,5.5 95.5,5.5 94,5.5 91.5,7.5 93,7.5 95.5,7.5 94,7.5 97,7.5 98.5,7.5 100,7.5 101.5,7.5 103,7.5 104.5,7.5 106,7.5 107.5,7.5 109,7.5 110.5,7.5 112,7.5 113.5,7.5 115,7.5 97,10.5 98.5,10.5 100,10.5 101.5,10.5 103,10.5 104.5,10.5 116.5,9 115,9 113.5,9 112,9 110.5,9 109,9 106,9 104.5,9 103,9 101.5,9 100,9 98.5,9 97,9 95,9 108.5,10.5 107.5,11.5 106.5,12.5 105.5,13.5 104.5,14.5 103.5,15.5 102.5,16.5 101.5,17.5 100.5,18.5 103.5,12 102.5,13 101.5,14 100.5,15 99.5,16 98.5,17 99.5,19.5 111,10.5 110,11.5 109,12.5 108,13.5 107,14.5 111.5,13 112.5,12 110.5,14 109.5,15 108.5,16 106,15.5 105,16.5 104,17.5 103,18.5 102,19.5 101,20.5 100,21.5 107.5,17 106.5,18 105.5,19 104.5,20 103.5,21 102.5,22 101.5,23 100.5,24 115,13.5 113,14.5 112,15.5 111,16.5 110,17.5 109,18.5 108,19.5 107,20.5 106,21.5 105,22.5 104,23.5 103,24.5 102,25.5 101,26.5 100,27.5 96.5,30.5 116.5,11.5 115,11.5 116,13.5 116,14.5 116,15.5 116,16.5 125,4 125.5,5.5 125.5,7 125.5,8.5 125.5,10 125.5,11.5 125.5,13 125.5,14.5 125.5,16 129,14 129,11.5 130.5,11.5 130.5,14 132,14 133.5,14 135,14 136.5,14 138,14 132,11.5 133.5,11.5 135,11.5 136.5,11.5 138,11.5 139.5,11.5 141,11.5 142,12.5 143,13.5 144,14.5 145,15.5 146,16.5 140,13 141,14 139,15 140,16 141,17 142,15 143,16 144,17 133.5,15.5 135,15.5 136.5,15.5 137.5,16.5 138.5,17.5 138.5,19 138.5,20.5 138.5,22 141,19 141,20.5 141,22 144,22 144,20.5 144,19 146.5,19 146.5,20.5 146.5,22 146.5,17.5 141,23.5 141,25 144,25 144,23.5 144,26.5 144,27.5 146.5,27.5 146.5,26.5 146.5,25 146.5,23.5 138.5,25.5 137.5,24.5 136.5,23.5 140.5,27.5 141.5,28.5 142.5,29.5 144,29.5 146.5,29.5 148,29.5 148,27.5 149.5,29.5 151,29.5 152,30.5 153,31.5 149.5,27.5 151,27.5 152.5,27.5 153.5,28.5 154.5,29.5 146.5,32.5 148,32.5 149.5,32.5 151,32.5 144,32.5 142.5,32.5 141.5,31.5 140.5,30.5 139.5,29.5 138.5,28.5 137.5,27.5 136.5,26.5 136.5,29.5 137.5,30.5 138.5,31.5 139.5,32.5 140.5,33.5 141.5,34.5 143,34.5 144.5,34.5 146,34.5 147.5,34.5 149,34.5 150.5,34.5 152,35 153,36 154,34.5 153,33.5 152,32.5 147.5,37.5 146,37.5 144.5,37.5 149,37.5 150.5,37.5 152,37.5 153,38.5 154,39.5 150.5,40 152,40 149,40 147.5,40 146,40 144.5,40 143,40 141.5,40 140,40 138.5,40 137,40 135.5,40 134,40 132.5,40 131,40 129.5,40 128,40 126.5,40 143,37.5 141.5,37.5 140,37.5 138.5,37.5 137,37.5 135.5,37.5 134,37.5 132.5,37.5 131,37.5 129.5,37.5 128,37.5 126.5,37.5 126.5,35 128,35 129.5,35 131,35 132.5,35 134,35 135.5,35 137,35 138.5,35 140,35 135.5,28.5 147.5,42 146,42 144.5,42 143,42 141.5,42 140,42 138.5,42 137,42 135.5,42 134,42 132.5,42 131,42 129.5,42 128,42 126.5,42 126.5,46.5 128,46.5 129.5,46.5 131,46.5 132.5,46.5 134,46.5 135.5,46.5 137,46.5 138.5,46.5 140,46.5 141.5,46.5 143,46.5 144.5,46.5 146,46.5 147.5,46.5 151,46.5 152.5,46.5 152,48.5 150.5,48.5 149,49 148,50 147,51 146,52 144.5,52 146,48.5 144.5,48.5 143,48.5 141.5,48.5 140,48.5 138.5,48.5 137,48.5 135.5,48.5 134,48.5 132.5,48.5 131,48.5 129.5,48.5 128,48.5 126.5,48.5 126.5,50 128,50 129.5,50 131,50 132.5,50 134,50 135.5,50 137,50 126.5,53.5 126.5,52 128,52 128,53.5 129.5,53.5 129.5,52 131,52 131,53.5 132.5,53.5 132.5,52 134,52 134,53.5 135.5,53.5 135.5,52 137,52 137,53.5 138.5,53.5 138.5,52 138.5,50 140,50 141.5,50 143,50 144.5,50 143,52 141.5,52 140,52 140,53.5 141.5,53.5 143,53.5 144.5,53.5 146,53.5 147.5,53.5 149,53.5 150.5,53.5 151.5,53 152.5,52 126.5,55.5 128,55.5 129.5,55.5 131,55.5 132.5,55.5 134,55.5 135.5,55.5 137,55.5 138.5,55.5 140,55.5 141.5,55.5 143,55.5 144.5,55.5 146,55.5 147.5,55.5 150.5,55.5 152,55 153,54 154,53 121,37.5 120,36.5 119,35.5 118,34.5 115.5,30 117.5,30 118.5,31 119,32.5 120,33.5 121,34.5 121,40 120,39.5 119,38.5 118,37.5 121,42 120,42 119,41.5 118,40.5 117,39.5 115.5,39.5 142,3 143.5,3 145,3 146.5,3 148,3 140.5,3 139,3 137.5,3 136,3 134.5,3 133,3 131.5,3 130,3 128.5,3 127,3 125.5,3 142,1 143.5,1 145,1 146.5,1 148,1 149.5,1 140.5,1 139,1 137.5,1 136,1 134.5,1 133,1 131.5,1 130,1 128.5,1 127,1 125.5,1 70,1 71.5,1 73,1 74.5,1 76,1 77.5,1 79,1 80.5,1 82,1 83.5,1 85,1 86.5,1 88,1 68.5,1 67,1 65.5,1 64,1 62.5,1 61,1 59.5,1 58,1 56.5,1 55,1 53.5,1 62.5,3 64,3 65.5,3 67,3 68.5,3 70,3 71.5,3 73,3 74.5,3 76,3 77.5,3 79,3 80.5,3 61,3 59.5,3 58,3 56.5,3 55,3 53.5,3 52,3 50.5,3 49,3 47.5,3 46,3 54,6 55.5,6 57,6 58.5,6 60,6 61.5,6 63,6 64.5,6 66,6 67.5,6 69,6 70.5,6 72,6 52.5,6 51,6 49.5,6 48,6 46.5,6 45,6 43.5,6 42,6 40.5,6 39,6 37.5,6 34,1 35.5,1 37,1 38.5,1 40,1 41.5,1 43,1 44.5,1 46,1 47.5,1 49,1 50.5,1 52,1 32.5,1 31,1 29.5,1 28,1 26.5,1 25,1 23.5,1 22,1 20.5,1 19,1 18,2 17,3 16,4 15.5,6 15.5,5 44.5,3 43,3 41.5,3 40,3 38.5,3 37,3 35.5,3 34,3 36,6 34.5,6 33,6 31.5,6 30,6 28.5,6 27,6 25.5,6 24,6 32.5,3 31,3 29.5,3 28,3 26.5,3 25,3 23.5,3 22,3 20.5,3 19.5,4 18.5,5 17.5,6 22.5,6 21,6 19.5,6 14.5,6 13.5,7 12.5,8 11.5,9 10.5,10 9.5,11.5 9.5,13 9.5,14.5 12,11.5 13,10.5 14,9.5 15,8.5 17.5,10.5 19.5,10.5 17.5,12 17.5,13.5 13,14.5 13.5,13 14.5,12 21,10.5 22.5,10.5 24,10.5 25.5,10.5 27,10.5 28.5,10.5 30,10.5 31.5,10.5 33,10.5 34.5,10.5 36,10.5 37.5,10.5 39,10.5 17.5,14.5 15.5,11 14,14.5 15,14.5 15,13 8,14.5 6.5,14.5 5,14.5 3.5,14.5 2,14.5 0.5,14.5 0.5,13 0.5,11.5 0.5,10 0.5,8.5 0.5,7 0.5,5.5 0.5,4 0.5,2.5 0.5,1 17.5,1 16,1 14.5,1 13,1 11.5,1 10,1 8.5,1 7,1 5.5,1 4,1 2.5,1 19,14.5 20.5,14.5 22,14.5 23.5,14.5 25,14.5 26.5,14.5 28,14.5 28.5,16 28.5,17.5 28.5,19 29.5,19.5 31,19.5 35.5,19.5 37,19.5 38,19 38,17.5 38,16 38,14.5 38,13 38.5,11.5 81,12.5 82.5,12.5 79.5,12.5 78,12.5 76.5,12.5 75,12.5 73.5,12.5 72,12.5 70.5,12.5 69,12.5 67.5,12.5 66,12.5 64.5,12.5 63,12.5 61.5,12.5 60,12.5 58.5,12.5 57,12.5 55.5,12.5 54,12.5 52.5,12.5 51,12.5 49.5,12.5 48,12.5 46.5,12.5 45,12.5 43.5,12.5 42,12.5 40.5,13.5 40.5,15 40.5,16.5 40.5,18 40.5,19.5 42,19.5 43.5,19.5 45,19.5 46.5,20.5 47.5,21.5 48.5,22.5 49.5,23.5 50.5,24.5 51.5,25.5 52.5,26.5 53.5,27.5 54.5,28.5 55.5,29.5 56.5,30.5 57.5,32 57.5,33.5 57.5,35 57.5,36.5 57.5,38 57.5,39.5 57.5,41 60.5,42 59,43 58,42 150.5,2 151.5,3 152.5,4 153.5,5 154.5,6 155.5,7 156.5,8 157.5,9 158.5,10 159,12 149,4 150,5 151,6 152,7 153,8 154,9 156,11 157,12 157,13.5 157,15 157,16.5 157,18 159,13.5 159,15 159,16.5 159,18 159,19.5 157,19.5 157,21 157,22.5 157,24 157,25.5 157,27 157,28.5 159,21 159,22.5 159,24 159,25.5 159,27 159,28.5 159,30 159,31.5 159,33 159,34.5 157,30 157,31.5 157,33 157,34.5 159,36 159,37.5 159,39 159,40.5 159,42 157,36 157,37.5 157,39 157,40.5 157,42 157,43.5 157,45 157,46.5 157,48 157,49.5 157,51 159,43.5 159,45 159,46.5 159,48 159,49.5 159,51 157,52.5 157,54 157,55.5 157,57 157,58.5 157,60 159,60 159,58.5 159,57 159,55.5 159,54 159,52.5 157,61.5 157,63 157,64.5 157,66 157,67.5 157,69 157,70.5 157,72 157,73.5 157,75 157,76.5 157,78 157,79.5 157,81 157,82.5 157,84 157,85.5 155.5,85.5 154,85 152.5,85 151,85 149.5,85 148,85 146.5,85 145,85 143.5,85 140.5,82.5 139.5,81.5 139,80 135,80 135,81.5 135,83 136,84 137.5,85 140.5,88 142,89 143.5,89 145,89 146.5,89 148,89 149.5,89 151,89 152.5,89 154,89 155.5,88.5 157,88.5 158,87.5 159,86.5 159,85.5 159,84 159,82.5 159,81 159,79.5 159,78 159,76.5 159,75 159,73.5 159,72 159,70.5 159,69 159,67.5 159,61.5 159,63 159,64.5 159,66 141.5,81.5 142.5,80.5 143.5,79.5 144.5,78.5 145.5,77.5 146.5,76.5 147.5,75.5 148.5,74.5 149.5,74.5 150.5,75 151.5,76 151.5,77 151,78 150,79 149,80 148,81 147,82 146,83 145,84 136,85 134.5,85 133,85 131.5,85 130,85 128.5,85 127,85 125.5,85 124,85 122.5,85 121,85 119.5,85 118,85 116.5,85 115,85 113.5,85 112,85 110.5,85 109,85 107.5,85 106,85 106,83.5 106,82 106,80.5 106,79 106,77.5 106,76 106,74.5 106,73 106,71.5 106,70 105,69 104,68 103,67 102,66 101,65 100,64 99,63 98,62 97,61 96,60 95,59 94,58 93,57 92,56 90.5,56 89,56 87.5,56 86,56 84.5,56 83,56 81.5,56 80,56 78.5,56 77,56 75.5,56 74,56 72.5,56 133.5,80 132,79.5 131,79 129.5,79 128,79 135,77 133.5,77 132,77 130.5,77 86,12.5 88,12.5 86,7.5 88,7.5 63,48 62,47 65,50 63,46 64,47 65,48 62,45 139.5,89 138.5,90 138.5,91.5 138.5,93 138.5,94.5 138.5,96 138.5,97.5 138.5,99 140,99.5 141.5,99.5 143,99.5 144.5,99.5 146,99.5 147.5,99.5 149,99.5 150.5,99.5 152,99.5 153.5,99.5 155,99.5 156.5,99.5 158,99.5 159.5,99.5 159.5,98 159.5,96.5 159.5,95 159.5,93.5 159.5,92 159.5,90.5 159.5,89 159.5,87.5
  pour Top: 160,0 0,0 0,15 28,15 28,20 45.5,20 57,31.5 57,42 61,46 61,48.5 63,50.5 65.5,50.5 71.5,56.5 91.5,56.5 105.5,70.5 105.5,85.5 138,85.5 138,100 160,100
  pour Bottom: 160,0 0,0 0,15 28,15 28,20 45.5,20 57,31.5 57,42 61,46 61,48.5 63,50.5 65.5,50.5 71.5,56.5 91.5,56.5 105.5,70.5 105.5,85.5 138,85.5 138,100 160,100
I2C_NINT  (via drill 0.35)
  Top 0.305: TP_I2C_NINT.P$1 142,33.5 v145.5,33.5 151.85,33.5 CON_BACKPLANE.22 | IC11.13 140.63,12.13 v145.5,17
  Bottom 0.305: v145.5,17 v145.5,33.5
I2C_SCL  (via drill 0.35)
  Top 0.305: TP_I2C_SCL.P$1 v142.5,28 143,28.5 151.93,28.5 CON_BACKPLANE.24 | IC11.14 138.91,13.4 v142.5,17
  Bottom 0.305: v142.5,17 v142.5,28
I2C_SDA  (via drill 0.35)
  Top 0.305: TP_I2C_SDA.P$1 v139.5,28 142.45,30.95 CON_BACKPLANE.23 | IC11.15 137.18,14.68 v139.5,17
  Bottom 0.305: v139.5,17 v139.5,28
N$1
  Bottom 1.016: RELAY3.2 33.15,52.49 R6.1 C32.1 33.15,47.51 RELAY3.7
N$4
  Top 1.016: L1.2 82,83.6 C7.+ 81.79,88.81 IC2.3
N$8
  Top 0.305: IC6.10 38.4,29.75 R12.2
N$9
  Top 0.305: IC5.10 38.4,69.75 R10.2
N$10
  Top 0.305: IC5.11 38.4,70.25 R11.2
N$14
  Top 0.305: IC6.11 38.4,30.25 R13.2
N$16
  Top 0.305: IC5.2 32.9,70.25 R15.2 31.2,70.65 R17.1 31,71.15 C53.1
N$17
  Top 0.305: IC5.1 32.97,72.35 R15.1 32.5,74 32.15,74.35 C53.2
N$18
  Top 0.305: IC5.4 32.97,67.65 R16.1 32.5,66 32.15,65.65 C54.1
N$19
  Top 0.305: IC5.3 32.9,69.75 R16.2 31.2,69.35 R18.1 31,68.85 C54.2
N$21
  Top 0.305: IC6.2 32.9,30.25 R19.2 31.2,30.65 R21.1 31,31.15 C55.1
N$22
  Top 0.305: IC6.1 32.97,32.35 R19.1 32.5,34 32.15,34.35 C55.2
N$24
  Top 0.305: IC6.3 32.9,29.75 R20.2 31.2,29.35 R22.1 31,28.85 C56.2
N$25
  Top 0.305: IC6.4 32.97,27.65 R20.1 32.5,26 32.15,25.65 C56.1
N$49
  Top 0.305: LED_+3.3V.C R1.1
N$50
  Top 0.305: R2.1 LED_+5V_ANALOG.C
N$78
  Top 0.305: ADC.36 66.68,51.5 66.5,51.5 66,52 66,52.23 ADC.38
N$81  (via drill 0.35)
  Top 0.305: ADC.37 68,53.52 v68,54
  Bottom 0.305: v68,54 67.6,54.4 R3.2
RD_NRESET  (via drill 0.35)
  Top 0.305: RD.3 v108.5,8.38 117.81,8.38 IC11.7 | TP_RD_NRESET.P$1 v106.5,10.5
  Bottom 0.305: v106.5,10.5 108.5,8.5 v108.5,8.38
RD_OUT1  (via drill 0.35)
  Top 0.305: RD.20 84.05,7 v78.5,7
  Bottom 0.305: v78.5,7 77.8,7.7 14.8,7.7 11,11.5 11,68 12,69 R27.1 14.2,68.55 RELAY1.1
RD_OUT2  (via drill 0.35)
  Top 0.305: v77.5,7 78.22,7.72 RD.19
  Bottom 0.305: v77.5,7 14.5,7 10.5,11 10.5,70 11.5,71 R28.1 14.2,71.45 RELAY1.8
RD_OUT3  (via drill 0.35)
  Top 0.305: RD.17 84.1,9 v78.5,9
  Bottom 0.305: RELAY2.1 14.2,28.55 R29.1 13,29 12,28 12,13.5 15.8,9.7 77.8,9.7 v78.5,9
RD_OUT4  (via drill 0.35)
  Top 0.305: v77.5,9 78.17,9.68 RD.16
  Bottom 0.305: RELAY2.8 14.2,31.45 R30.1 12.5,31 11.5,30 11.5,13 15.5,9 v77.5,9
RD_OUT5  (via drill 0.35)
  Top 0.305: RD.14 v78.5,10.97
  Bottom 0.305: v78.5,10.97 77.88,11.6 40.9,11.6 39.5,13 39.5,51.5 38.46,52.54 RELAY3.1 36.5,52.74 R31.1
RD_OUT6  (via drill 0.35)
  Top 0.305: RD.13 78.12,11.62 v77.5,11
  Bottom 0.305: v77.5,11 40.5,11 39,12.5 39,46.5 38,47.5 36.5,47.5 36.38,47.38 | RELAY3.8 36.38,47.38 | 36.38,47.38 36.5,47.26 R32.1
REGCAPA  (via drill 0.35)
  Top 0.305: ADC.61 57.9,50.92 v57.9,50.1
  Bottom 0.305: C25.1 v57.9,50.1 C24.1
REGCAPB  (via drill 0.35)
  Top 0.305: ADC.52 61.4,53.78 v61.4,53.6
  Bottom 0.305: C23.1 v61.4,53.6 C22.1
SHIELD  (via drill 0.35)
  other vias: 26.5,83.5 26.5,82 26.5,80.5 26.5,79 26.5,77.5 26.5,76 26.5,74.5 26.5,16.5 26.5,18 26.5,19.5 26.5,21 26.5,22.5 26.5,24 26.5,25.5 26.5,28.5 26.5,31.5 26.5,34.5 26.5,36 26.5,37.5 26.5,39 26.5,41 26.5,42.5 26.5,44 26.5,45.5 26.5,47 26.5,59 26.5,57.5 26.5,56 26.5,54.5 26.5,53 26.5,51.5 28,51.5 28,48.5 26.5,48.5 29.5,48.5 29.5,51.5 31,51.5 31,48.5 31,50 29.5,50 28,50 26.5,50 26.5,61 26.5,62.5 26.5,64 26.5,65.5 26.5,68.5 26.5,71.5 25,16.5 23.5,16.5 22,16.5 20.5,16.5 19,16.5 17.5,16.5 15,16.5 14,16.5 13,16.5 9.5,16.5 8,16.5 6.5,16.5 5,16.5 3.5,16.5 2,16.5 0.5,16.5 0.5,18 0.5,19.5 0.5,21 0.5,22.5 0.5,24 0.5,25.5 0.5,27 0.5,28.5 0.5,30 0.5,31.5 0.5,33 0.5,34.5 0.5,36 0.5,37.5 0.5,39 0.5,40.5 0.5,42 0.5,43.5 0.5,45 0.5,46.5 0.5,48 0.5,49.5 0.5,50.5 0.5,52 0.5,53.5 0.5,55 0.5,56.5 0.5,58 0.5,59.5 0.5,61 0.5,62.5 0.5,64 0.5,65.5 0.5,67 0.5,68.5 0.5,70 0.5,71.5 0.5,73 0.5,74.5 0.5,76 0.5,77.5 0.5,79 0.5,80.5 0.5,82 0.5,83.5 2,83.5 3.5,83.5 5,83.5 6.5,83.5 8,83.5 9.5,83.5 11,83.5 12.5,83.5 14,83.5 15.5,83.5 17,83.5 18.5,83.5 20,83.5 21.5,83.5 23,83.5 25,83.5
  pour Top: 0,84 27,84 27,54 31.5,54 31.5,46 27,46 27,16 0,16
  pour Bottom: 0,84 27,84 27,54 31.5,54 31.5,46 27,46 27,16 0,16
SPI_CONFIG_ADC_NCS  (via drill 0.35)
  Top 0.305: IC11.5 112.14,10.87 TP_SPI_CONFIG_ADC_NCS.P$1 | ADC.16 69.62,34.5 v88.5,34.5
  Bottom 0.305: v88.5,34.5 TP_SPI_CONFIG_ADC_NCS.P$1
SPI_CONFIG_CLK
  Top 0.305: CON_BACKPLANE.21 121.03,36.03 TP_SPI_CONFIG_CLK.P$1 114,31.5 110,35.5 94,35.5 | ADC.17 71.2,35.5 94,35.5 | RD.6 92.33,10.32 94,12 94,35.5
SPI_CONFIG_MISO  (via drill 0.35)
  Top 0.305: CON_BACKPLANE.19 120.11,41.11 TP_SPI_CONFIG_MISO.P$1 93,37.5 | ADC.19 70.61,37.5 93,37.5 | RD.7 91.97,10.97 93,12 v93,34.5 | v93,37.54 93,37.5
  Bottom 0.305: v93,34.5 v93,37.54
SPI_CONFIG_MOSI  (via drill 0.35)
  Top 0.305: CON_BACKPLANE.20 152.27,39 121,39 TP_SPI_CONFIG_MOSI.P$1 114.5,34.5 112.5,36.5 v95,36.5 70.9,36.5 ADC.18 | RD.5 92.67,9.68 95,12 v95,34.5
  Bottom 0.305: v95,34.5 v95,36.5
SPI_CONFIG_RD_NCS
  Top 0.305: RD.4 93.03,9.03 93.59,9.6 110.41,9.6 | IC11.6 110.5,9.6 110.41,9.6 | TP_SPI_CONFIG_RD_NCS.P$1 110.41,9.6
SPI_DATA_CLK  (via drill 0.35)
  Top 0.305: v147.5,49 145.5,51 TP_SPI_DATA_CLK.P$1 113,51 107.5,45.5 68.97,45.5 ADC.28
  Bottom 0.305: v147.5,49 149.3,47.2 CON_BACKPLANE.17
SPI_DATA_MOSI
  Top 0.305: CON_BACKPLANE.18 153.07,47.5 TP_SPI_DATA_MOSI.P$1 111,47.5 108.5,45 68.77,45 ADC.27
SPI_DATA_NCS
  Top 0.305: CON_BACKPLANE.16 151.15,54.5 TP_SPI_DATA_NCS.P$1 115,54.5 106.5,46 69.18,46 ADC.29
VCM  (via drill 0.35)
  Top 0.305: IC6.9 37.44,28.57 v38,28 | v38,68 37.44,68.56 IC5.9 | v38,54 41.35,54 C40.1 41.5,52.65 R14.2 41.65,51.65 v41.5,51.5 | v38,46 41.5,46 | 41.5,46 v41.5,48.5 | TP_VCM.P$1 41.5,46
  Bottom 0.305: v38,28 v38,46 | v38,54 v38,68 | v41.5,51.5 v41.5,48.5
VCM_ADC  (via drill 0.35)
  Top 0.305: ADC.59 58,52.23 v58,52 | R14.1 v48,52.5
  Bottom 0.305: v58,52 56.7,53.3 56.7,55.8 56,56.5 55,56.5 51,52.5 v48,52.5 45.5,55 TP_VCM_ADC.P$1
VREF_5V
  Top 0.305: IC3.6 84.86,65.28 C31.2 | TP_VREF_5V.P$1 85.15,61.85 C31.2 | SJ1.1 C31.2

## Text on the board
tPlace: ANALOG CONVERSION / v3, pd, 2022 | SJ1: ADC_REF / 1: VREF_5V / 3: +5V_ANALOG | 3 | 1